# EAGLE design fm_trap (EAGLE 7.6.0)
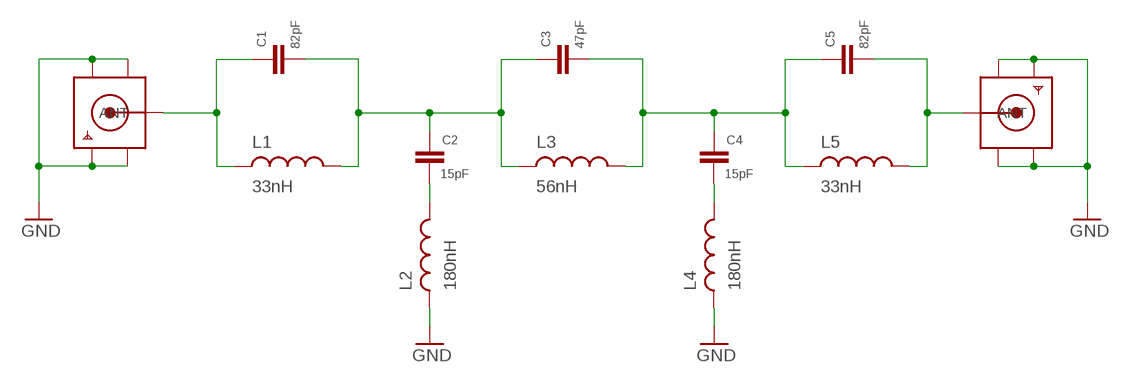
[diagram p0: schematic, sheet 1]

## Parts
C1  82pF  0805CAP  [0805]
C2  15pF  0805CAP  [0805]
C3  47pF  0805CAP  [0805]
C4  15pF  0805CAP  [0805]
C5  82pF  0805CAP  [0805]
L1  33nH  1008INDUCTOR  [1008INDUCTOR]
L2  180nH  1008INDUCTOR  [1008INDUCTOR]
L3  56nH  1008INDUCTOR  [1008INDUCTOR]
L4  180nH  1008INDUCTOR  [1008INDUCTOR]
L5  33nH  1008INDUCTOR  [1008INDUCTOR]
X1  SMACONNECTOR_EDGE  [SMA_EDGELAUNCH]
X2  SMACONNECTOR_EDGE  [SMA_EDGELAUNCH]

## Nets
GND: L2.P$1 L4.P$1 X1.GND@1(GND4) X1.GND@2(GND3) X1.GND@3(GND2) X1.GND@4(GND1) X2.GND@1(GND4) X2.GND@2(GND3) X2.GND@3(GND2) X2.GND@4(GND1)
N$1 [RF]: C1.P$1 C2.P$2 C3.P$2 L1.P$2 L3.P$1
N$2 [RF]: C5.P$1 L5.P$2 X2.P(ANT)
N$3 [RF]: C2.P$1 L2.P$2
N$5 [RF]: C1.P$2 L1.P$1 X1.P(ANT)
N$24 [RF]: C3.P$1 C4.P$2 C5.P$2 L3.P$2 L5.P$1
N$25 [RF]: C4.P$1 L4.P$2

## Library data of the parts
C1-C5 = Samsung-Passives:0805CAP
L1-L5 = FerroCore:1008INDUCTOR
X1 X2 = adafruit:SMACONNECTOR: SMA Connector 90° DIP SMA Connector, 50 Ohm (4UConnector: 07259)

## Net classes
1 RF: width 1.016 mm, clearance 0.508 mm

## Board
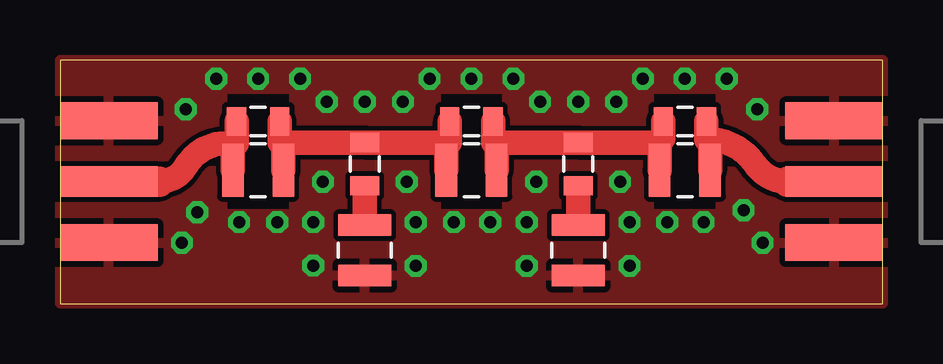
[diagram p1: board, top side]
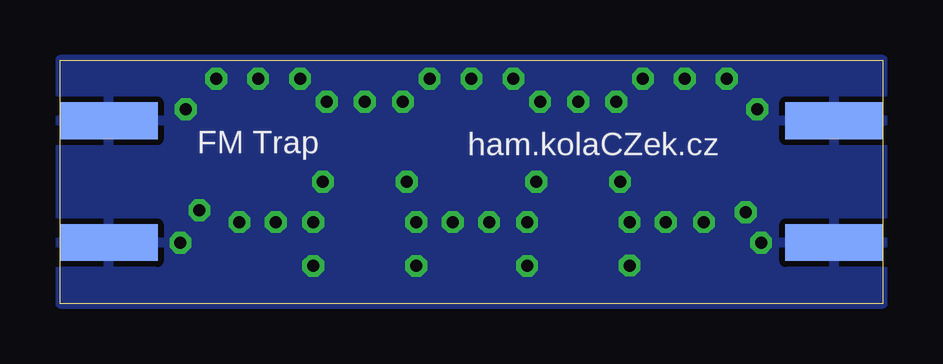
[diagram p2: board, bottom side, seen from below]

Size 34.29 x 10.15 mm. Coordinates in mm from the lower left corner, seen from the top.
Outline: 0,0 34.29,0 34.29,10.15 0,10.15 0,0
Copper layers (1*16): Top 0.035mm / dielectric 1.5mm / Bottom 0.035mm
Design rules "default *": minimum track width 10mil, minimum drill 24mil, track to track 8mil, track to pad 8mil, pad to pad 8mil, via to via 8mil, smd to smd 8mil, copper to edge 0mil, drill to drill 8mil, minimum pad ring 10mil, minimum via ring 8mil, stop-mask expansion 4mil, vias tented up to drill 100mil, thermal gap 10mil

### Footprints (pad centres in the part's own frame; a part is rotated, then mirrored left to right if it is on the bottom)
0805 = smd 0.8 x 1.2: P$1 -0.9,0; P$2 0.9,0
1008INDUCTOR = smd 0.9 x 2.2: P$1 -1.05,0; P$2 1.05,0
SMA_EDGELAUNCH = smd 4.064 x 1.524: GND@1 2.032,-2.54; GND@2 2.032,2.54 | smd 4.064 x 1.524 bottom: GND@3 2.032,2.54; GND@4 2.032,-2.54 | smd 4.064 x 1.27: P 2.032,0

### Placement (x,y rotation side)
C1  8.26,7.59 180 top
C2  12.7,5.81 90 top
C3  17.14,7.59 180 top
C4  21.59,5.81 90 top
C5  26.04,7.59 180 top
L1  8.26,5.56 0 top
L2  12.7,2.22 90 top
L3  17.14,5.56 0 top
L4  21.59,2.22 90 top
L5  26.04,5.56 0 top
X1  0,5.08 0 top
X2  34.29,5.08 180 top

### Tracks (layer width: path | path; a pad name or v marks a point on that pad's centre or on a via)
GND  (via drill 0.5)
  other vias: 5.24,8.1 6.51,9.37 8.26,9.37 10,9.37 11.11,8.41 14.29,8.41 24.29,9.37 26.04,9.37 27.78,9.37 29.05,8.1 10.95,5.08 9.05,3.4 7.46,3.4 5.08,2.54 14.45,5.08 26.81,3.4 29.27,2.54 28.48,3.89 12.7,8.41 5.71,3.81 10.56,3.4 10.56,1.59 25.3,3.4 14.83,3.4 14.83,1.57 19.84,5.08 19.45,3.4 19.45,1.57 23.34,5.08 23.73,3.4 23.73,1.57 16.41,3.4 17.92,3.4 20,8.41 21.59,8.41 23.18,8.41 15.4,9.37 17.14,9.37 18.89,9.37
  pour Top: 0,10.16 34.29,10.16 34.29,0 0,0
  pour Bottom: 0,10.16 34.29,10.16 34.29,0 0,0
  cutout Top: 6.99,3.95 9.53,3.95 9.53,8.72 6.99,8.72
  cutout Top: 24.77,3.95 27.3,3.95 27.3,8.72 24.77,8.72
  cutout Top: 15.88,3.95 18.41,3.95 18.41,8.72 15.88,8.72
N$1
  Top 0.254: L1.P$2 9.15,5.56
  Top 1.016: 9.3,6.71 C2.P$2 16.09,6.71 | 9.3,6.71 L1.P$2 | 9.3,6.71 9.15,6.71 C1.P$1 | 16.09,6.71 L3.P$1 | 16.09,6.71 16.25,6.71 C3.P$2
N$2
  Top 1.016: 30.32,5.08 arc-56 28.97,5.79 arc48 27.3,6.83 27.09,6.83 | 27.09,6.83 L5.P$2 | C5.P$1 26.93,6.83 27.09,6.83
  Top 1.27: X2.P 30.32,5.08
N$3
  Top 0.254: L2.P$2 12.7,3.81 | C2.P$1 12.7,4.5
  Top 1.016: 12.7,3.65 12.7,3.81 12.7,4.5
N$5
  Top 1.016: 4.13,5.08 arc59 5.24,5.71 arc-52 6.67,6.67 7.21,6.67 | 7.21,6.67 L1.P$1 | C1.P$2 7.36,6.67 7.21,6.67
  Top 1.27: X1.P 4.13,5.08
N$24
  Top 1.016: 18.2,6.71 C4.P$2 24.98,6.71 | 18.2,6.71 L3.P$2 | 18.2,6.71 18.05,6.71 C3.P$1 | 24.98,6.71 L5.P$1 | C5.P$2 25.14,6.86 24.98,6.71
N$25
  Top 0.254: L4.P$2 21.59,3.81 | C4.P$1 21.59,4.6
  Top 1.016: 21.59,4.6 21.59,3.81

### Text on the board
bNames: ham.kolaCZek.cz | FM Trap